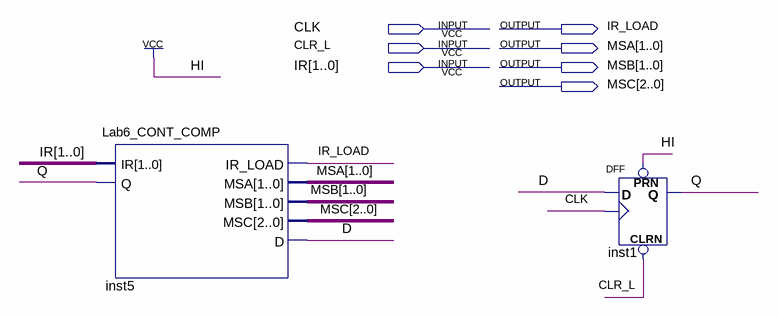
[diagram p0: schematic sheet]
// Quartus schematic Lab6_CONT.bdf as structural Verilog: 2 symbols, 7 pins
module Lab6_CONT (
  input  CLK,
  input  CLR_L,
  input  [1:0] IR,
  output IR_LOAD,
  output [1:0] MSA,
  output [1:0] MSB,
  output [2:0] MSC
);

  wire D, Q;

  Lab6_CONT_COMP inst5 (.IR(IR), .Q(Q), .IR_LOAD(IR_LOAD), .MSA(MSA), .MSB(MSB), .MSC(MSC), .D(D));
  DFF inst1 (.CLRN(CLR_L), .CLK(CLK), .D(D), .PRN(1'b1), .Q(Q));
endmodule
